# Altium project MotorBoardV2.PrjPcb
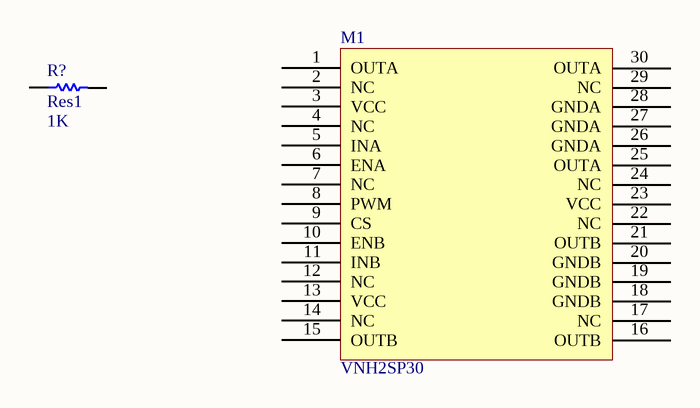
[diagram p0: MotorBoardSch.SchDoc]
1 sheet, 2 parts. Net scope: global (net labels, ports and power ports of the same name join across sheets).

## Sheet MotorBoardSch.SchDoc
size A4

### Parts
M1  VNH2SP30  [VNH5019]
R?  Res1  value 1K  [AXIAL-0.3]

### Nets

Not connected (* = marked no-connect by the designer): M1 1(OUTA) 2(NC) 3(VCC) 4(NC) 5(INA) 6(ENA) 7(NC) 8(PWM) 9(CS) 10(ENB) 11(INB) 12(NC) 13(VCC) 14(NC) 15(OUTB) 16(OUTB) 17(NC) 18(GNDB) 19(GNDB) 20(GNDB) 21(OUTB) 22(NC) 23(VCC) 24(NC) 25(OUTA) 26(GNDA) 27(GNDA) 28(GNDA) 29(NC) 30(OUTA); R? 1 2

### Library data of the parts
R? = Res1: Resistor; Published: 8-Jun-2000; LatestRevisionDate: 17-Jul-2002; LatestRevisionNote: Re-released for DXP Platform.; PackageReference: AXIAL-0.3; Publisher: Altium Limited; PackageDescription: Axial Device, Thru-Hole; 2 Leads; 0.3 in Pin Spacing